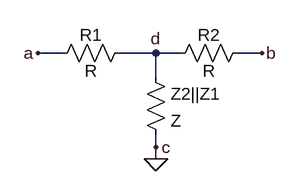
[diagram p0: schematic basic schaltung.asc]
basic schaltung.asc, the LTspice schematic file:
Version 4
SHEET 1 880 680
WIRE -48 128 -80 128
WIRE 80 128 32 128
WIRE 112 128 80 128
WIRE 224 128 192 128
WIRE 80 160 80 128
WIRE 80 256 80 240
WIRE 80 272 80 256
FLAG 80 272 0
FLAG -80 128 a
FLAG 224 128 b
FLAG 80 256 c
FLAG 80 128 d
SYMBOL res -64 144 R270
WINDOW 0 25 56 VTop 2
WINDOW 3 7 56 VBottom 2
SYMATTR InstName R1
SYMBOL res 96 144 R270
WINDOW 0 25 56 VTop 2
WINDOW 3 7 56 VBottom 2
SYMATTR InstName R2
SYMBOL res 64 144 R0
SYMATTR InstName Z2||Z1
SYMATTR Value Z

The netlist it stands for:
* basic schaltung.asc
R1 a d R
R2 d b R
R§Z2||Z1 d 0 Z
.backanno
.end